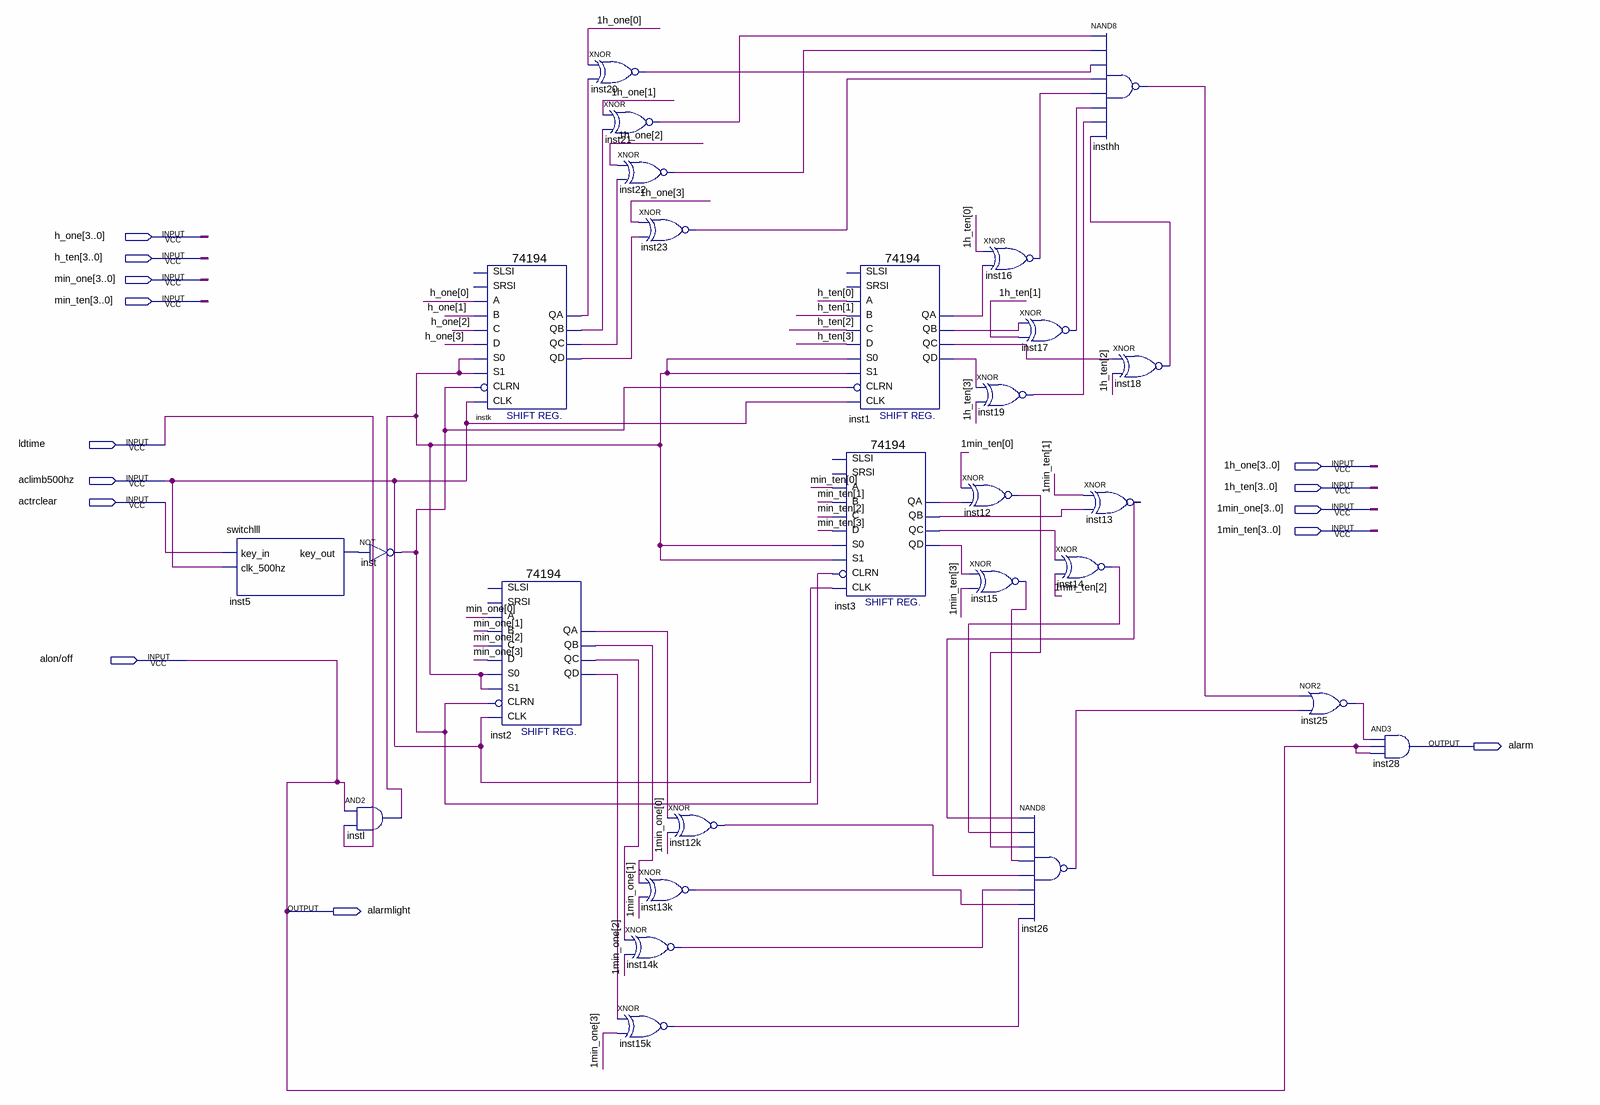
[diagram p0: schematic sheet]
// Quartus schematic timealarm.bdf as structural Verilog: 27 symbols, 14 pins
module timealarm (
  input  [3:0] h_one,
  input  [3:0] h_ten,
  input  [3:0] min_one,
  input  [3:0] min_ten,
  input  ldtime,
  input  [3:0] \1h_one ,
  input  aclimb500hz,
  input  [3:0] \1h_ten ,
  input  actrclear,
  input  [3:0] \1min_one ,
  input  [3:0] \1min_ten ,
  input  \alon/off ,
  output alarm,
  output alarmlight
);

  wire inst1_qa, inst1_qb, inst1_qc, inst1_qd, inst2_qa, inst2_qb, inst2_qc, inst2_qd, inst3_qa, inst3_qb,
       inst3_qc, inst3_qd, inst5_key_out, inst12_out, inst12k_out, inst13_out, inst13k_out, inst14_out,
       inst14k_out, inst15_out, inst15k_out, inst16_out, inst17_out, inst18_out, inst19_out, inst20_out,
       inst21_out, inst22_out, inst23_out, inst25_out, inst26_out, inst_out, insthh_out, instk_qa, instk_qb,
       instk_qc, instk_qd, instl_out;

  switchlll inst5 (.key_in(actrclear), .clk_500hz(aclimb500hz), .key_out(inst5_key_out));
  and instl (instl_out, \alon/off , ldtime);
  not inst (inst_out, inst5_key_out);
  \74194  instk (
    .B(h_one[1]), .C(h_one[2]), .CLK(aclimb500hz), .CLRN(inst_out), .D(h_one[3]), .S1(instl_out),
    .S0(instl_out), .A(h_one[0]), .QA(instk_qa), .QB(instk_qb), .QC(instk_qc), .QD(instk_qd));  // open: SLSI, SRSI
  \74194  inst2 (
    .B(min_one[1]), .C(min_one[2]), .CLK(aclimb500hz), .CLRN(inst_out), .D(min_one[3]), .S1(instl_out),
    .S0(instl_out), .A(min_one[0]), .QA(inst2_qa), .QB(inst2_qb), .QC(inst2_qc), .QD(inst2_qd));  // open: SLSI, SRSI
  xnor inst20 (inst20_out, \1h_one [0], instk_qa);
  xnor inst21 (inst21_out, \1h_one [1], instk_qb);
  xnor inst22 (inst22_out, \1h_one [2], instk_qc);
  xnor inst23 (inst23_out, \1h_one [3], instk_qd);
  xnor inst13k (inst13k_out, inst2_qb, \1min_one [1]);
  xnor inst14k (inst14k_out, inst2_qc, \1min_one [2]);
  xnor inst15k (inst15k_out, inst2_qd, \1min_one [3]);
  xnor inst12k (inst12k_out, inst2_qa, \1min_one [0]);
  \74194  inst1 (
    .B(h_ten[1]), .C(h_ten[2]), .CLK(aclimb500hz), .CLRN(inst_out), .D(h_ten[3]), .S1(instl_out),
    .S0(instl_out), .A(h_ten[0]), .QA(inst1_qa), .QB(inst1_qb), .QC(inst1_qc), .QD(inst1_qd));  // open: SLSI, SRSI
  \74194  inst3 (
    .B(min_ten[1]), .C(min_ten[2]), .CLK(aclimb500hz), .CLRN(inst_out), .D(min_ten[3]), .S1(instl_out),
    .S0(instl_out), .A(min_ten[0]), .QA(inst3_qa), .QB(inst3_qb), .QC(inst3_qc), .QD(inst3_qd));  // open: SLSI, SRSI
  xnor inst16 (inst16_out, \1h_ten [0], inst1_qa);
  xnor inst19 (inst19_out, inst1_qd, \1h_ten [3]);
  xnor inst12 (inst12_out, \1min_ten [0], inst3_qa);
  xnor inst15 (inst15_out, inst3_qd, \1min_ten [3]);
  xnor inst17 (inst17_out, inst1_qb, \1h_ten [1]);
  nand inst26 (inst26_out, inst13_out, inst14_out, inst12_out, inst15_out, inst12k_out, inst14k_out, inst13k_out, inst15k_out);
  nand insthh (insthh_out, inst21_out, inst22_out, inst20_out, inst23_out, inst16_out, inst17_out, inst19_out, inst18_out);
  xnor inst13 (inst13_out, \1min_ten [1], inst3_qb);
  xnor inst14 (inst14_out, inst3_qc, \1min_ten [2]);
  xnor inst18 (inst18_out, inst1_qc, \1h_ten [2]);
  nor inst25 (inst25_out, insthh_out, inst26_out);
  and inst28 (alarm, inst25_out, \alon/off , \alon/off );

  assign alarmlight = \alon/off ;
endmodule
